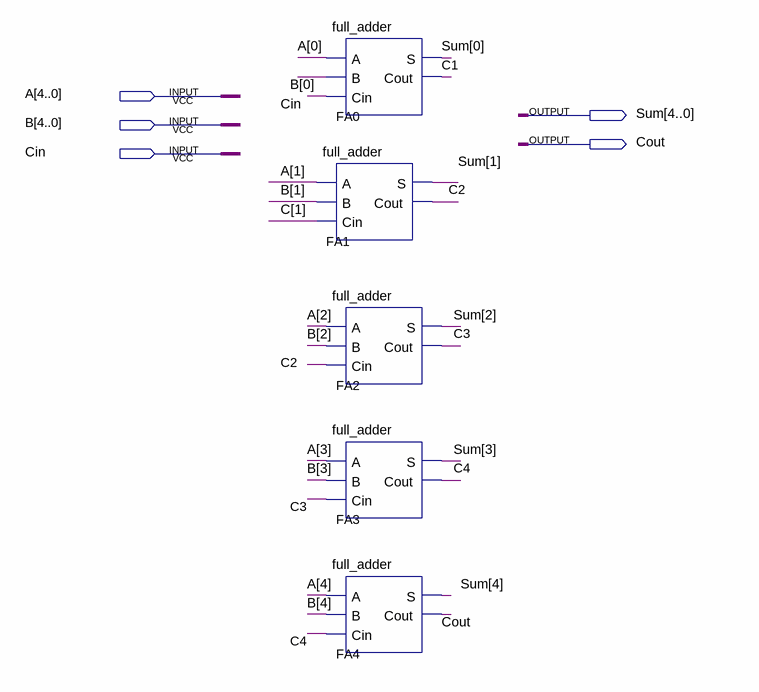
[diagram p0: schematic sheet]
// Quartus schematic somador_completo.bdf as structural Verilog: 5 symbols, 5 pins
module somador_completo (
  input  [4:0] A,
  input  [4:0] B,
  input  Cin,
  output [4:0] Sum,
  output Cout
);

  wire C2, C3, C4;
  wire [1:1] C;

  full_adder FA0 (.A(A[0]), .B(B[0]), .Cin(Cin), .S(Sum[0]), .Cout(C[1]));
  full_adder FA1 (.A(A[1]), .B(B[1]), .Cin(C[1]), .S(Sum[1]), .Cout(C2));
  full_adder FA2 (.A(A[2]), .B(B[2]), .Cin(C2), .S(Sum[2]), .Cout(C3));
  full_adder FA3 (.A(A[3]), .B(B[3]), .Cin(C3), .S(Sum[3]), .Cout(C4));
  full_adder FA4 (.A(A[4]), .B(B[4]), .Cin(C4), .S(Sum[4]), .Cout(Cout));
endmodule
